# EAGLE design NextPro-v1 (EAGLE 7.3.0)
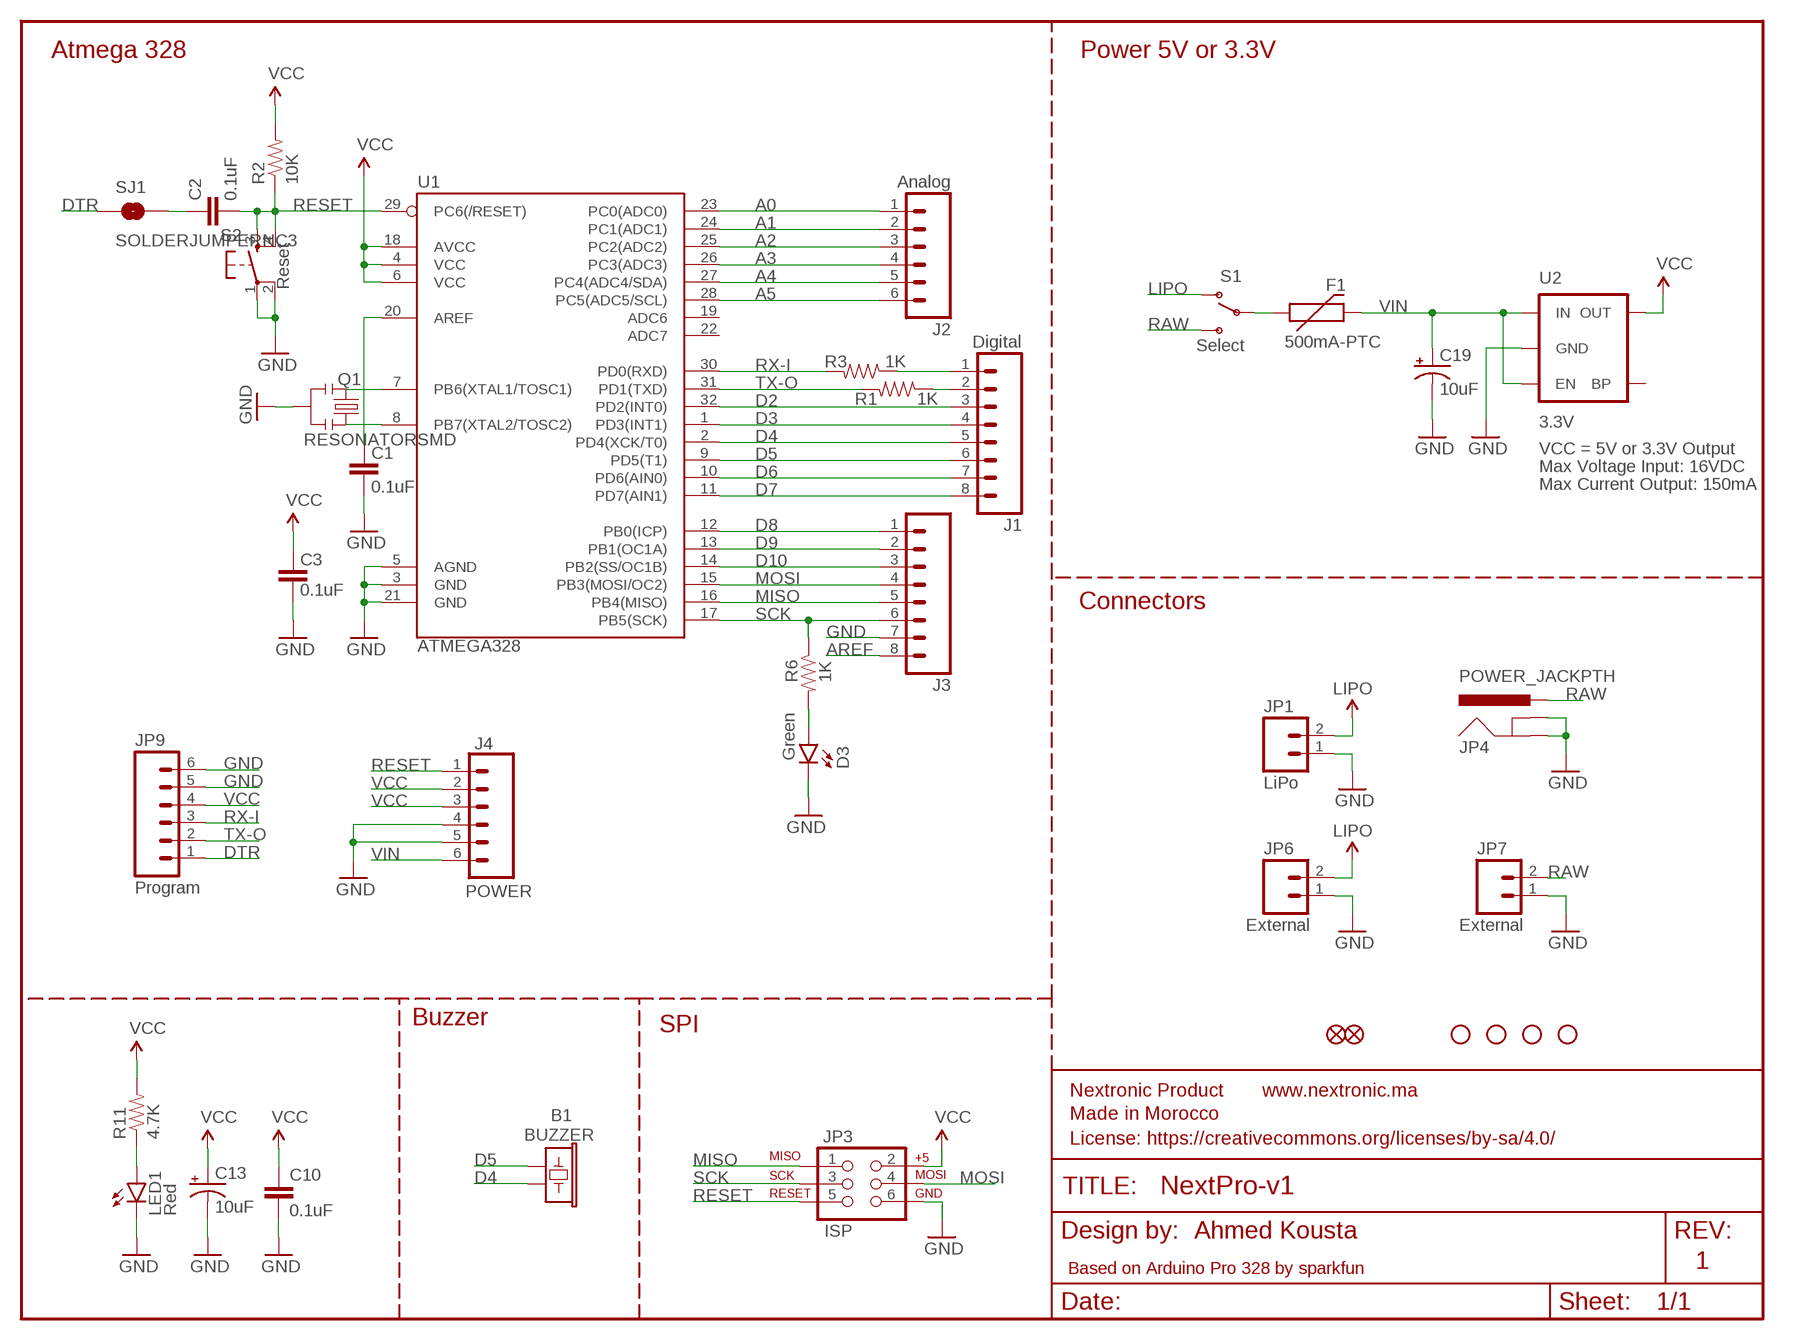
[diagram p0: schematic, sheet 1]

## Parts
B1  BUZZER  BUZZERPTH  [BUZZER-12MM]
C1  0.1uF  0.1UF-25V-5%(0603)  [0603-CAP]
C2  0.1uF  0.1UF-25V-5%(0603)  [0603-CAP]
C3  0.1uF  0.1UF-25V-5%(0603)  [0603-CAP]
C10  0.1uF  0.1UF-25V-5%(0603)  [0603-CAP]
C13  10uF  CAP_POL1206  [EIA3216]
C19  10uF  CAP_POL1206  [EIA3216]
D3  Green  LED1206  [LED-1206]
F1  500mA-PTC  PTCSMD  [PTC-1206]
FRAME1  FRAME-LETTER  [CREATIVE_COMMONS]
J1  Digital  M081X08  [1X08]
J2  Analog  M06SIP  [1X06]
J3  M081X08  [1X08]
J4  POWER  M06SIP  [1X06]
JP1  LiPo  M02JST-PTH-2  [JST-2-PTH]
JP2  FIDUCIAL1X2.5  [FIDUCIAL-1X2.5]
JP3  ISP  AVR_SPI_PRG_6PTH  [2X3]
JP4  POWER_JACKPTH  [POWER_JACK_PTH]
JP5  FIDUCIAL1X2.5  [FIDUCIAL-1X2.5]
JP6  External  M02PTH  [1X02]
JP7  External  M021X02_NO_SILK  [1X02_NO_SILK]
JP9  Program  M06SILK_FEMALE_PTH  [1X06]
LED1  Red  LED1206  [LED-1206]
Q1  RESONATORSMD  [RESONATOR-SMD]
R1  1K  1KOHM-1/10W-1%(0603)  [0603-RES]
R2  10K  1KOHM-1/10W-1%(0603)  [0603-RES]
R3  1K  1KOHM-1/10W-1%(0603)  [0603-RES]
R6  1K  1KOHM-1/10W-1%(0603)  [0603-RES]
R11  4.7K  1KOHM-1/10W-1%(0603)  [0603-RES]
S1  Select  SWITCH-SPDTSMD  [AYZ0202]
S2  Reset  TAC_SWITCHPTH  [TACTILE-PTH]
SJ1  SOLDERJUMPERNC3  SOLDERJUMPERNC2  [SJ_2S-NOTRACE]
U1  ATMEGA328  ATMEGA168  [TQFP32-08]
U2  3.3V  V_REG_LDOSMD  [SOT23-5]
U$1  STAND-OFF  [STAND-OFF]
U$3  STAND-OFF  [STAND-OFF]
U$9  STAND-OFF  [STAND-OFF]
U$10  STAND-OFF  [STAND-OFF]

## Nets
A0: J2.1 U1.23(PC0(ADC0))
A1: J2.2 U1.24(PC1(ADC1))
A2: J2.3 U1.25(PC2(ADC2))
A3: J2.4 U1.26(PC3(ADC3))
A4: J2.5 U1.27(PC4(ADC4/SDA))
A5: J2.6 U1.28(PC5(ADC5/SCL))
AREF: C1.2 J3.8 U1.20(AREF)
D2: J1.3 U1.32(PD2(INT0))
D3: J1.4 U1.1(PD3(INT1))
D4: B1.- J1.5 U1.2(PD4(XCK/T0))
D5: B1.+ J1.6 U1.9(PD5(T1))
D6: J1.7 U1.10(PD6(AIN0))
D7: J1.8 U1.11(PD7(AIN1))
D8: J3.1 U1.12(PB0(ICP))
D9: J3.2 U1.13(PB1(OC1A))
D10: J3.3 U1.14(PB2(SS/OC1B))
DTR: JP9.1 SJ1.1
GND [vcc]: C1.1 C3.1 C10.2 C13.C(-) C19.C(-) D3.C J3.7 J4.4 J4.5 JP1.1 JP3.6 JP4.GND JP4.GNDBREAK JP6.1 JP7.1 JP9.5 JP9.6 LED1.C Q1.2 S2.1 S2.2 U1.3(GND) U1.5(AGND) U1.21(GND) U2.2(GND)
LIPO: JP1.2 JP6.2 S1.1(O)
MISO: J3.5 JP3.1 U1.16(PB4(MISO))
MOSI: J3.4 JP3.4 U1.15(PB3(MOSI/OC2))
N$1: C2.1 SJ1.2
N$3: Q1.1 U1.8(PB7(XTAL2/TOSC2))
N$4: Q1.3 U1.7(PB6(XTAL1/TOSC1))
N$7: D3.A R6.2
N$25: F1.1 S1.2(P)
N$38: LED1.A R11.1
RAW [vcc]: JP4.PWR JP7.2 S1.3(S)
RESET: C2.2 J4.1 JP3.5 R2.1 S2.3 S2.4 U1.29(PC6(/RESET))
RX-I: JP9.3 R3.2 U1.30(PD0(RXD))
RX-IP: J1.2 R1.1
SCK: J3.6 JP3.3 R6.1 U1.17(PB5(SCK))
TX-O: JP9.2 R1.2 U1.31(PD1(TXD))
TX-OP: J1.1 R3.1
VCC: C3.2 C10.1 C13.A(+) J4.2 J4.3 JP3.2 JP9.4 R2.2 R11.2 U1.4(VCC) U1.6(VCC) U1.18(AVCC) U2.5(OUT)
VIN [vcc]: C19.A(+) F1.2 J4.6 U2.1(IN) U2.3(EN)
Unconnected: U1.19(ADC6) U1.22(ADC7) U2.4(BP)

## Notes on the sheet
- Atmega 328 | Power 5V or 3.3V
- VCC = 5V or 3.3V Output
- Max Voltage Input: 16VDC
- Max Current Output: 150mA
- Connectors
- Buzzer | SPI
- Ahmed Kousta
- 1
- Based on Arduino Pro 328 by sparkfun

## Library data of the parts
B1 = SparkFun:BUZZER: Buzzer 12mm Spark Fun Electronics SKU : Comp-Buzzer
C1-C3 C10 = SparkFun-Capacitors:0.1UF-25V-5%(0603): CAP-08604; PROD_ID: CAP-08604
C13 C19 = SparkFun:CAP_POL: Capacitor Polarized These are standard SMD and PTH capacitors. Normally 10uF, 47uF, and 100uF in electrolytic and tantalum varieties. Always verify the external diameter of the through hole cap, it varies with capacity, voltage, and manufacturer. The EIA devices should be standard.
D3 LED1 = SparkFun-LED:LED: LEDs Standard schematic elements and footprints for 5mm, 3mm, 1206, and 0603 sized LEDs. 5mm - Spark Fun Electronics SKU : COM-00529 (and others)
F1 = SparkFun:PTC: Resettable Fuse PTC Resettable Fuse. Spark Fun Electronics SKU : COM-08357
FRAME1 = SparkFun-Aesthetics:FRAME-LETTER: Schematic Frame Standard 8.5x11 US Letter frame
J1 J3 = SparkFun:M08: Header 8 Standard 8-pin 0.1" header. Use with straight break away headers (SKU : PRT-00116), right angle break away headers (PRT-00553), swiss pins (PRT-00743), machine pins (PRT-00117), and female headers (PRT-00115).
J2 J4 = SparkFun:M06: Header 6 Standard 6-pin 0.1" header. Use with straight break away headers (SKU : PRT-00116), right angle break away headers (PRT-00553), swiss pins (PRT-00743), machine pins (PRT-00117), and female headers (PRT-00115). Molex polarized connector foot print use with SKU : PRT-08094 with associated ...
JP1 = SparkFun-Connectors:M02: Standard 2-pin 0.1" header. Use with - straight break away headers ( PRT-00116) - right angle break away headers (PRT-00553) - swiss pins (PRT-00743) - machine pins (PRT-00117) - female headers (PRT-00115) Molex polarized connector foot print use with: PRT-08233 with associated crimp pins and housings. 2.54_SCREWTERM for use with PRT-10571. 3.5mm Screw Terminal footprints for PRT-08084 5mm Screw Terminal footprints for use with PRT-08432; PROD_ID: CONN-09863; SKU: PRT-09914
JP2 JP5 = abes:FIDUCIAL: Fiducial Alignment Points Various fiducial points for machine vision alignment.
JP3 = SparkFun:AVR_SPI_PRG_6: AVR ISP 6 Pin This is the reduced ISP connector for AVR programming. Common on Arduino. This footprint will take up less PCB space and can be used with a 10-pin to 6-pin adapter such as SKU: BOB-08508
JP4 = SparkFun:POWER_JACK: Power Jack This is the standard 5.5mm barrel jack for power. The PTH is the most common, proven, reliable, footprint. All others are experimental. The Slot footprint only works if the mill layer is transmitted to the PCB fab house so be warned. Spark Fun Electronics SKU : PRT-00119. Mating wall wart : TOL-00298 (and others)
JP6 = SparkFun:M02: Header 2 Standard 2-pin 0.1" header. Use with straight break away headers (SKU : PRT-00116), right angle break away headers (PRT-00553), swiss pins (PRT-00743), machine pins (PRT-00117), and female headers (PRT-00115). Molex polarized connector foot print use with SKU : PRT-08233 with associated crimp pins and housings.
JP7 = SparkFun-Connectors:M02: Standard 2-pin 0.1" header. Use with - straight break away headers ( PRT-00116) - right angle break away headers (PRT-00553) - swiss pins (PRT-00743) - machine pins (PRT-00117) - female headers (PRT-00115) Molex polarized connector foot print use with: PRT-08233 with associated crimp pins and housings. 2.54_SCREWTERM for use with PRT-10571. 3.5mm Screw Terminal footprints for PRT-08084 5mm Screw Terminal footprints for use with PRT-08432
JP9 = SparkFun-Connectors:M06: Header 6 Standard 6-pin 0.1" header. Use with straight break away headers (SKU : PRT-00116), right angle break away headers (PRT-00553), swiss pins (PRT-00743), machine pins (PRT-00117), and female headers (PRT-00115). Molex polarized connector foot print use with SKU : PRT-08094 with associated ...; PROD_ID: CONN-08437
Q1 = SparkFun:RESONATOR: Resonator Small SMD resonator. This is the itty bitty 10/20MHz resonators with built in caps. CSTCE10M0G55 and CSTCE20M0V53. Footprint has been reviewed closely but hasn't been tested yet.
R1 R3 R6 = SparkFun-Resistors:1KOHM-1/10W-1%(0603): RES-07856; PROD_ID: RES-07856
R2 R11 = SparkFun-Resistors:1KOHM-1/10W-1%(0603): RES-07856; PROD_ID: RES-07856; VALUE: 1K
S1 = SparkFun-Electromechanical:SWITCH-SPDT: SPDT Switch Simple slide switch, Spark Fun Electronics SKU : COM-00102 DPDT SMT slide switch, AYZ0202, SWCH-08179; PROD_ID: SWCH-08179; SF_ID: COM-00597
S2 = SparkFun-Retired:TAC_SWITCH: Momentary Switch Button commonly used for reset or general input. Spark Fun Electronics SKU : COM-00097 SMT- SWCH-08247
SJ1 = SparkFun:SOLDERJUMPER: Solder Jumper Standard SMD solder jumper. Used to automate production. Two varients : Normally Open and Normally Closed are the same, but have different paste layers. NC will have a large amount of paste and should jumper during reflow.
U1 = SparkFun:ATMEGA168
U2 = SparkFun:V_REG_LDO: Voltage Regulator LDO Standard 150mA LDO voltage regulator in SOT-23 layout. Micrel part MIC5205. BP (by-pass) pin is used to lower output noise with 470pF cap.
U$1 U$3 U$9 U$10 = SparkFun:STAND-OFF: Stand Off This is the mechanical footprint for a #4 phillips button head screw. Use the keepout ring to avoid running the screw head into surrounding components. SKU : PRT-00447

## Net classes
0 default: width 0.203 mm
1 vcc: width 0.254 mm

## Board
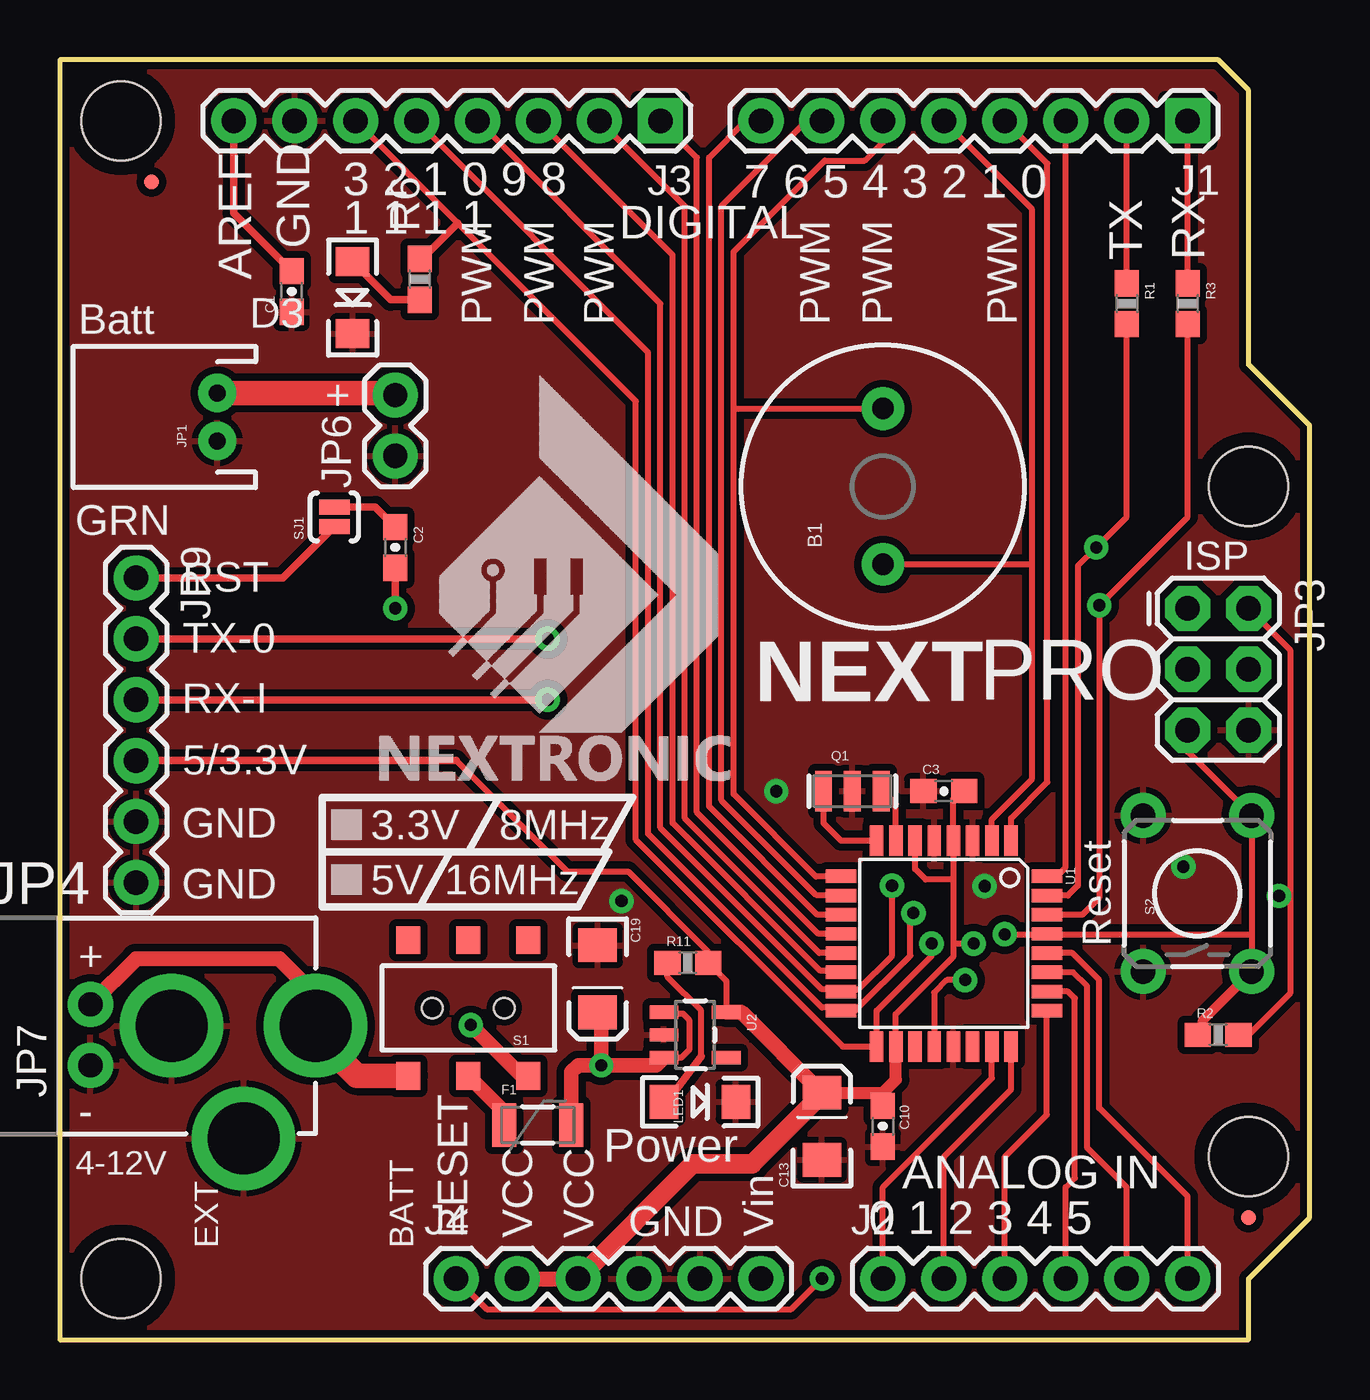
[diagram p1: board, top side]
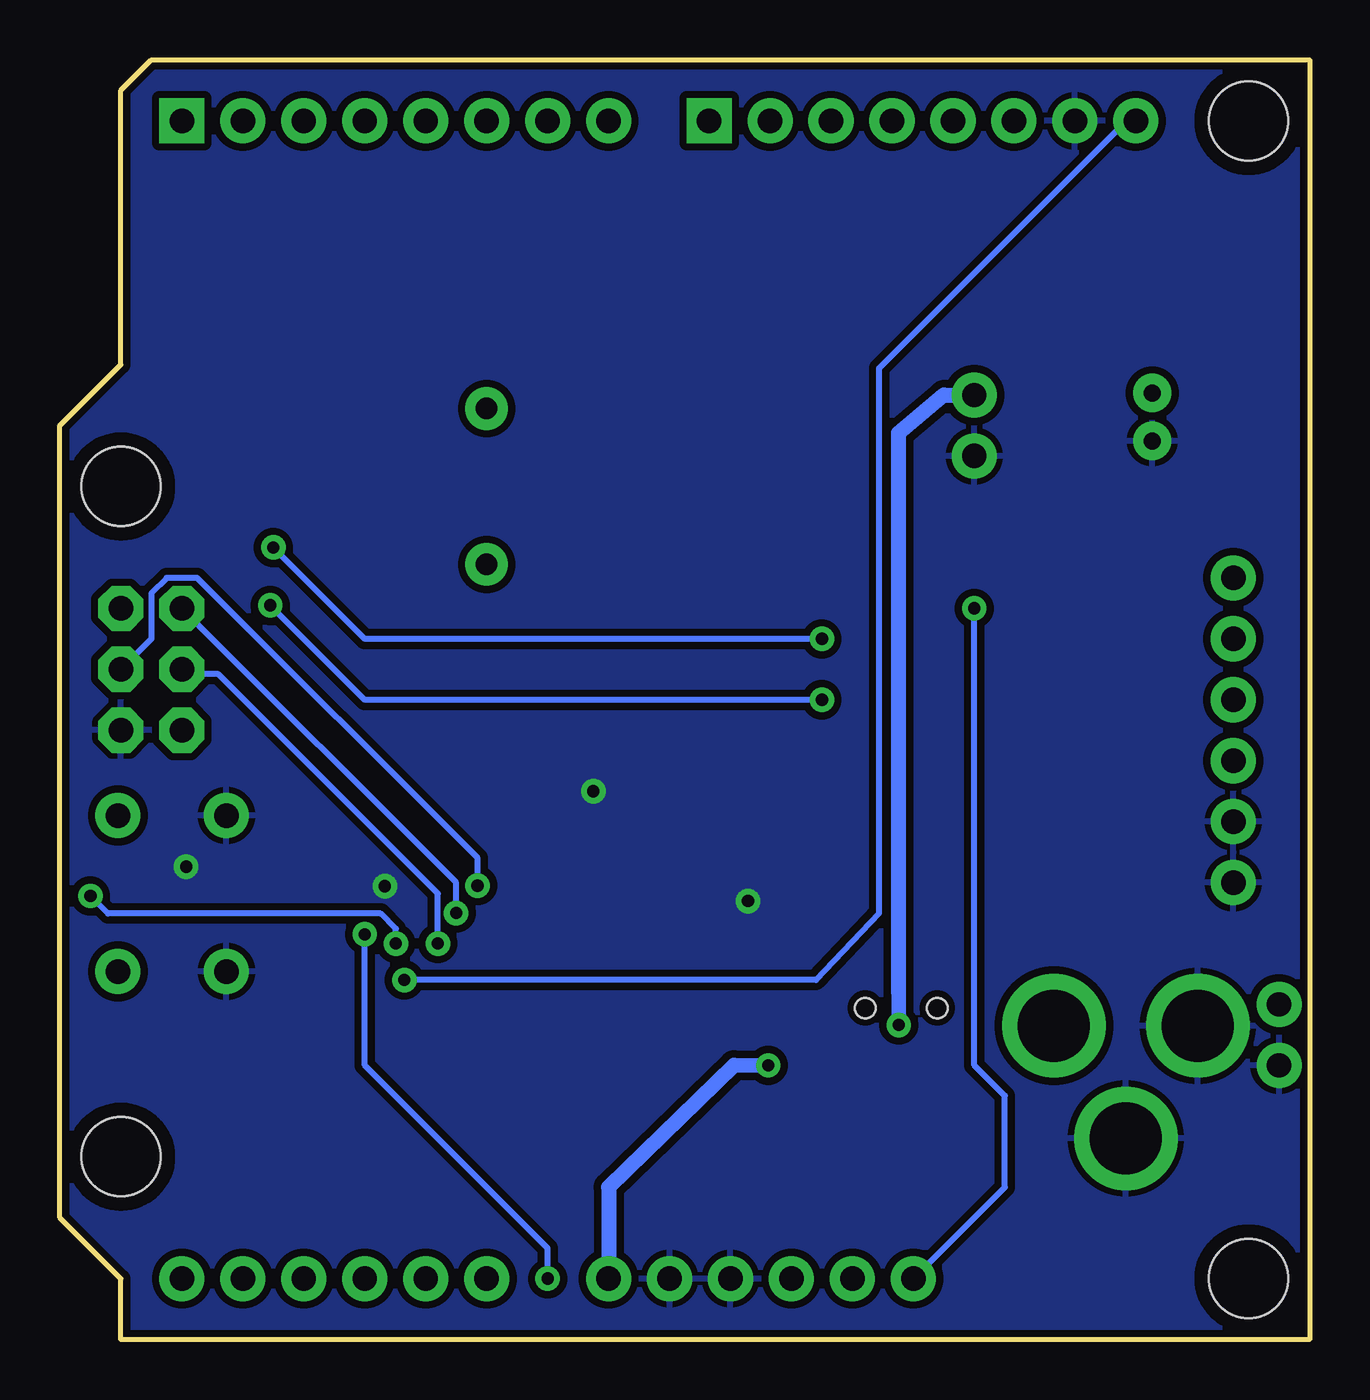
[diagram p2: board, bottom side, seen from below]

Size 52.07 x 53.34 mm. Coordinates in mm from the lower left corner, seen from the top.
Outline: 0,53.34 0,0 49.53,0 49.53,2.54 52.07,5.08 52.07,38.1 49.53,40.64 49.53,52.07 48.26,53.34 0,53.34
Copper layers (1*16): Top 0.035mm / dielectric 1.5mm / Bottom 0.035mm
Design rules "SparkFun": minimum track width 8mil, minimum drill 20mil, track to track 8mil, track to pad 8mil, pad to pad 8mil, via to via 8mil, smd to smd 8mil, copper to edge 10mil, drill to drill 8mil, minimum pad ring 12mil, minimum via ring 10mil, stop-mask expansion 4mil, vias tented up to drill 20mil, thermal gap 10mil

### Footprints (pad centres in the part's own frame; a part is rotated, then mirrored left to right if it is on the bottom)
BUZZER-12MM = drill 0.9 pad 1.778: + 3.25,0; - -3.25,0
0603-CAP = smd 1.1 x 1: 1 -0.85,0; 2 0.85,0
EIA3216 = smd 1.4 x 1.6: A 1.4,0; C -1.4,0
LED-1206 = smd 1.2 x 1.4: A -1.5,0; C 1.5,0
PTC-1206 = smd 1 x 1.8: 1 -1.4,0; 2 1.4,0
1X08 = drill 1.016 pad 1.88 square: 1 0,0 | drill 1.016 pad 1.88: 2 2.54,0; 3 5.08,0; 4 7.62,0; 5 10.16,0; 6 12.7,0; 7 15.24,0; 8 17.78,0
1X06 = drill 1.016 pad 1.88: 1 0,0; 2 2.54,0; 3 5.08,0; 4 7.62,0; 5 10.16,0; 6 12.7,0
JST-2-PTH = drill 0.7 pad 1.6: 1 -1,0; 2 1,0
FIDUCIAL-1X2.5 = smd 0.635 x 0.635: 1 0,0
2X3 = drill 1.016 pad 1.88 octagon: 1 0,0; 2 0,2.54; 3 2.54,0; 4 2.54,2.54; 5 5.08,0; 6 5.08,2.54
POWER_JACK_PTH = drill 2.997 pad 4.318: GND 0,7.7; GNDBREAK 4.7,10.7; PWR 0,13.7
1X02 = drill 1.016 pad 1.88: 1 0,0; 2 2.54,0
1X02_NO_SILK = drill 1.016 pad 1.88: 1 0,0; 2 2.54,0
RESONATOR-SMD = smd 0.7 x 1.7: 1 -1.2,0; 2 0,0; 3 1.2,0
0603-RES = smd 1.1 x 1: 1 -0.85,0; 2 0.85,0
AYZ0202 = smd 1 x 1.15: 1 -2.5,2.825; 2 0,2.825; 3 2.5,2.825; 4 -2.5,-2.825; 5 0,-2.825; 6 2.5,-2.825 | hole 0.85: 1.5,0; -1.5,0
TACTILE-PTH = drill 1.016 pad 1.88: 1 -3.251,2.261; 2 3.251,2.261; 3 -3.251,-2.261; 4 3.251,-2.261
SJ_2S-NOTRACE = smd 0.635 x 1.27: 1 -0.401,0; 2 0.413,0
TQFP32-08 = smd 1.27 x 0.559: 1 -4.293,2.8; 2 -4.293,2; 3 -4.293,1.2; 4 -4.293,0.4; 5 -4.293,-0.4; 6 -4.293,-1.2; 7 -4.293,-2; 8 -4.293,-2.8; 17 4.293,-2.8; 18 4.293,-2; 19 4.293,-1.2; 20 4.293,-0.4; 21 4.293,0.4; 22 4.293,1.2; 23 4.293,2; 24 4.293,2.8 | smd 0.559 x 1.27: 9 -2.8,-4.293; 10 -2,-4.293; 11 -1.2,-4.293; 12 -0.4,-4.293; 13 0.4,-4.293; 14 1.2,-4.293; 15 2,-4.293; 16 2.8,-4.293; 25 2.8,4.293; 26 2,4.293; 27 1.2,4.293; 28 0.4,4.293; 29 -0.4,4.293; 30 -1.2,4.293; 31 -2,4.293; 32 -2.8,4.293
SOT23-5 = smd 0.55 x 1.2: 1 -0.95,-1.3; 2 0,-1.3; 3 0.95,-1.3; 4 0.95,1.3; 5 -0.95,1.3
STAND-OFF = hole 3.302: 0,0

### Placement (x,y rotation side)
B1  34.29,35.56 90 top
C1  9.65,43.69 90 top
C2  13.97,33.02 270 top
C3  36.83,22.86 0 top
C10  34.29,8.89 270 top
C13  31.75,8.89 90 top
C19  22.4,15.04 270 top
D3  12.19,43.43 270 top
F1  19.91,8.94 0 top
FRAME1  -4.06,-5.94 0 top  (outside the outline)
J1  46.99,50.8 180 top
J2  34.29,2.54 0 top
J3  25.02,50.8 180 top
J4  16.51,2.54 0 top
JP1  6.55,38.46 90 top
JP2  49.53,5.08 0 top
JP3  46.99,30.48 270 top
JP4  -3.05,13.08 270 top
JP5  3.81,48.26 0 top
JP6  13.97,36.83 90 top
JP7  1.27,11.43 90 top
JP9  3.17,31.75 270 top
LED1  26.67,9.91 0 top
Q1  33.02,22.86 0 top
R1  44.45,43.18 270 top
R2  48.26,12.7 0 top
R3  46.99,43.18 270 top
R6  14.99,44.2 270 top
R11  26.16,15.7 0 top
S1  17.02,13.82 180 top
S2  47.4,18.59 90 top
SJ1  11.43,34.29 90 top
U1  36.83,16.51 270 top
U2  26.47,12.7 270 top
U$1  2.54,50.8 0 top
U$3  2.54,2.54 0 top
U$9  49.53,35.56 0 top
U$10  49.53,7.62 0 top

### Tracks (layer width: path | path; a pad name or v marks a point on that pad's centre or on a via)
A0
  Top 0.254: U1.23 38.83,10.89 34.29,6.35 J2.1
A1
  Top 0.254: U1.24 39.63,10.42 36.83,7.62 J2.2
A2
  Top 0.254: U1.25 41.12,9.37 39.37,7.62 39.37,2.79 39.5,2.67 J2.3
A3
  Top 0.254: U1.26 42.01,14.51 42.29,14.22 42.29,6.73 41.91,6.35 J2.4
A4
  Top 0.254: U1.27 42.22,15.31 42.8,14.73 42.8,8 44.45,6.35 J2.5
A5
  Top 0.254: U1.28 42.18,16.11 43.31,14.99 43.31,9.65 46.99,5.97 J2.6
AREF  (via drill 0.51)
  Top 0.254: U1.20 36.43,14.46 36.96,14.99 v37.72,14.99
  Top 0.305: J3.8 7.24,46.95 C1.2
  Bottom 0.254: v37.72,14.99 20.57,14.99 17.93,17.78 17.93,40.49 7.62,50.8 J3.8
D2
  Top 0.254: U1.32 41.52,19.31 41.53,19.3 41.91,19.68 J1.3
D3
  Top 0.254: U1.1 39.63,21.72 41.15,23.24 41.15,49.02 J1.4
D4
  Top 0.254: U1.2 38.83,21.68 40.51,23.37 40.51,32.26 | 40.51,32.26 40.51,47.12 J1.5 | B1.- 40.46,32.31 40.51,32.26
D5
  Top 0.254: U1.9 32.64,19.3 | U1.9 | U1.9 31.5,19.3 28.07,22.73 28.07,38.86 | 28.07,38.86 28.07,45.34 31.88,49.15 33.53,49.15 34.29,49.91 J1.6 | B1.+ 28.12,38.81 28.07,38.86
D6
  Top 0.254: U1.10 32.42,18.51 32.39,18.54 31.5,18.54 27.56,22.48 27.56,47.24 31.12,50.8 J1.7
D7
  Top 0.254: U1.11 31.57,17.71 27.05,22.22 27.05,49.28 28.58,50.8 J1.8
D8
  Top 0.254: U1.12 31.6,16.91 26.54,21.97 26.54,49.28 J3.1
D9
  Top 0.254: U1.13 31.64,16.11 26.03,21.72 26.03,47.24 J3.2
D10
  Top 0.254: J3.3 25.53,45.21 25.53,21.53 31.69,15.37 32.51,15.37 32.51,15.33 U1.14
DTR
  Top 0.305: JP9.1 9.29,31.75 SJ1.1
GND  (via drill 0.51)
  other vias: 29.84,22.86 23.4,18.28 46.81,19.71 38.53,18.9
  pour Top (isolate 0.305): 0,53.34 52.07,53.34 52.07,0 0,0
  pour Bottom (isolate 0.305): 0,53.34 52.07,53.34 52.07,0 0,0
LIPO  (via drill 0.5)
  Top 0.61: v17.12,13.11 19.23,10.99 S1.1
  Top 1.016: JP6.2 13.88,39.46 JP1.2
  Bottom 0.61: 17.12,14.48 v17.12,13.11
  Bottom 0.635: JP6.2 15.24,39.37 17.12,37.8 17.12,14.48
MISO  (via drill 0.51)
  Top 0.254: J3.5 24.51,41.15 24.51,21.08 31.75,13.84 32.64,13.84 32.54,13.74 U1.16 | U1.16 | U1.16 32.63,13.71 32.64,13.72 33.15,13.72 35.43,16 35.43,17.65 v35.56,17.78
  Bottom 0.254: JP3.1 35.56,19.05 v35.56,17.78
MOSI  (via drill 0.51)
  Top 0.254: J3.4 25.02,43.18 25.02,21.34 31.75,14.61 32.51,14.61 32.54,14.58 U1.15 | 32.64,14.48 32.57,14.48 U1.15 | v34.67,18.92 34.67,16 33.27,14.61 32.77,14.61 32.64,14.48 | 32.64,14.48 32.61,14.51 U1.15
  Bottom 0.254: JP3.4 48.26,29.21 48.26,31.11 47.63,31.75 46.36,31.75 34.67,20.07 v34.67,18.92
N$1
  Top 0.305: SJ1.2 13.14,34.7 C2.1
N$3
  Top 0.254: U1.8 32.54,20.8 31.82,21.52 Q1.1
N$4
  Top 0.254: Q1.3 34.29,22.86 34.83,22.32 U1.7
N$7
  Top 0.305: R6.2 13.78,43.35 D3.A
N$25
  Top 0.61: S1.2 18.51,9.5 F1.1
N$38
  Top 0.254: 26.72,11.81 26.72,13.72 25.31,15.12 R11.1
  Top 0.305: 26.72,11.81 25.65,10.39 LED1.A
RAW
  Top 0.635: JP7.2 3.17,15.88 9.14,15.88 10.67,14.35 10.67,12.7 JP4.PWR
  Top 1.016: 10.67,12.7 12.38,10.99 S1.3
RESET  (via drill 0.51)
  Top 0.254: J4.1 17.78,1.27 30.48,1.27 v31.75,2.54 | v39.37,16.89 41.02,16.89 41.04,16.91 U1.29 41.26,16.91 41.28,16.89 49.63,16.89 49.66,16.92 | 47.63,12.7 R2.1 | 49.66,16.92 S2.4 46.99,24.51 JP3.5 | 49.66,16.92 S2.3
  Top 0.305: C2.2 v13.97,30.48
  Top 0.406: 47.63,12.7 47.63,13.31 S2.3
  Bottom 0.254: v39.37,16.89 39.37,11.43 31.75,3.81 v31.75,2.54 | J4.1 12.7,6.35 12.7,10.16 13.97,11.43 v13.97,30.48
RX-I  (via drill 0.51)
  Top 0.254: U1.30 42.6,17.71 43.31,18.41 v43.31,30.61 46.99,34.29 R3.2
  Top 0.305: JP9.3 v20.32,26.67
  Bottom 0.254: v20.32,26.67 39.37,26.67 v43.31,30.61
RX-IP
  Top 0.254: R1.1 J1.2
SCK  (via drill 0.51)
  Top 0.254: J3.6 16.57,46.55 24,39.12 24,20.83 32.61,12.22 U1.17 34.03,13.71 36.32,16 v36.32,16.51
  Top 0.305: R6.1 15.07,45.05 16.57,46.55
  Bottom 0.254: v36.32,16.51 36.32,18.59 45.47,27.74 46.79,27.74 JP3.3
TX-O  (via drill 0.51)
  Top 0.254: U1.31 42.01,18.51 42.42,18.92 42.42,32.26 v43.18,33.02 44.45,34.29 R1.2
  Top 0.305: v20.32,29.21 JP9.2
  Bottom 0.254: v20.32,29.21 39.37,29.21 v43.18,33.02
TX-OP
  Top 0.254: R3.1 J1.1
VCC  (via drill 0.51)
  Top 0.254: 34.29,10.29 C10.1 | C13.A 31.75,10.16 | 27.61,13.59 27.67,13.65 U2.5 27.77,14.94 R11.2 27.01,16.17 23.67,19.51 21.13,19.51 16.51,24.13 | U1.18 34.82,13.56 37.24,15.98 37.24,16.51 | 37.24,20.81 37.24,20.9 | 37.24,20.81 U1.4 37.23,22.57 37.52,22.86 C3.2 | 37.24,16.51 37.24,19.18 | 37.24,19.18 37.24,20.81 | JP3.2 51.26,28.75 51.26,18.44 | 37.24,16.51 v38.08,16.51 | R2.2 49.53,12.7 51.26,14.43 51.26,18.44 | U1.6 35.63,19.61 36.07,19.18 37.24,19.18 | v50.8,18.49 50.85,18.44 51.26,18.44
  Top 0.305: 16.51,24.13 JP9.4
  Top 0.508: U1.18 34.83,10.83 34.29,10.29 31.88,10.29
  Top 0.635: U2.5 28.39,13.65 C13.A 31.87,10.29 31.88,10.29 | J4.2 J4.3
  Top 0.813: J4.3 26.37,7.31 28.85,7.31 31.75,10.21 C13.A
  Bottom 0.254: v38.08,16.51 38.08,17.12 38.71,17.75 50.06,17.75 v50.8,18.49
VIN  (via drill 0.51)
  Top 0.254: U2.3 25.9,11.75 26.21,12.06 26.21,13.33 25.96,13.59 25.2,13.59 25.17,13.62 U2.1
  Top 0.61: F1.2 21.31,11.15 21.6,11.43 v22.56,11.43 | U2.3 24.85,11.43 v22.56,11.43 | C19.A 22.56,13.33 v22.56,11.43
  Bottom 0.61: 23.98,11.43 v22.56,11.43
  Bottom 0.635: J4.6 29.21,6.35 23.98,11.43

### Text on the board
tPlace: 3 2 1 0 9 8 | 7 6 5 4 3 2 1 0 | 1 1 1 1 | GND | DIGITAL | AREF | TX | RX | PWM | PWM | PWM | PWM | PWM | PWM | Batt | + | - | GRN | ISP | RST | TX-0 | RX-I | NEXT | PRO | 5/3.3V | GND | 3.3V | 8MHz | GND | 5V | 16MHz | Reset | + | - | Power | 4-12V | ANALOG IN | RESET | VCC | VCC | GND | Vin | 0 1 2 3 4 5 | EXT | BATT
tValues: DNP | DNP | DNP | JST-Right Angle | Production: DNP | Production: DNP | Proto: 2x3 male header up | DNP | DNP | DNP